# Altium schematic sheet NFC-Interface.SchDoc
size A3
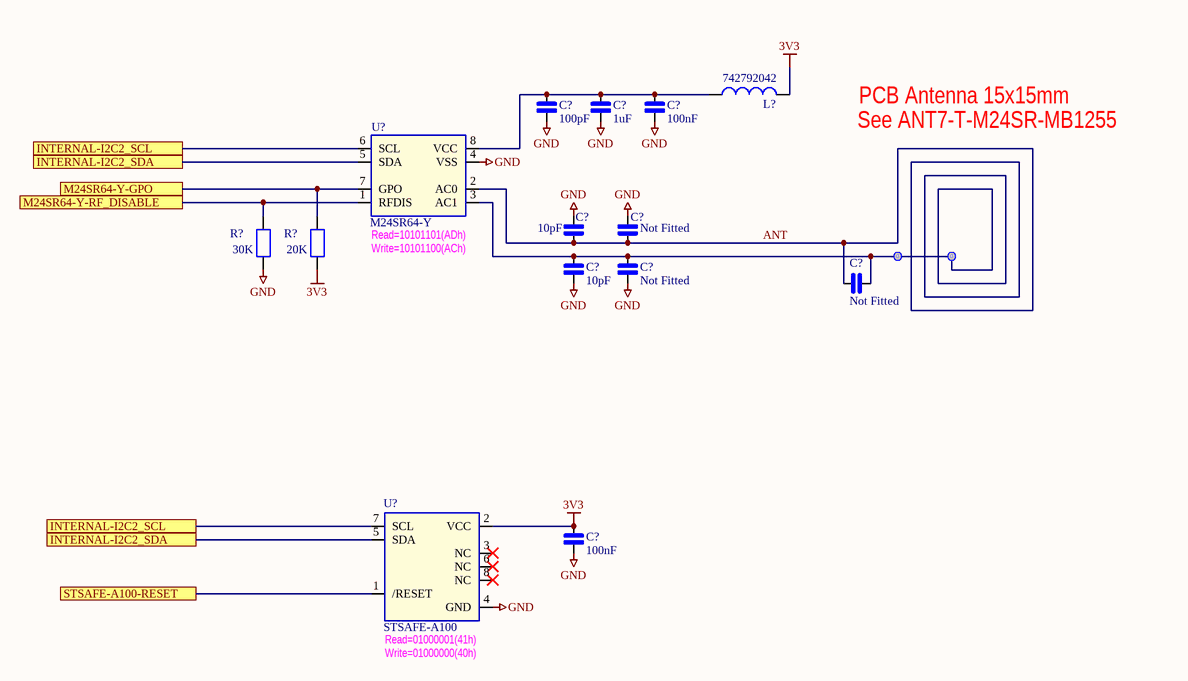
[diagram p0: NFC-Interface.SchDoc]

## Parts
(Parts that share a designator on the sheet are numbered #1, #2 ... from top to bottom, then left to right.)
C?#1  100pF  [0402_CAP_NPOL]
C?#2  1uF  [0402_CAP_NPOL]
C?#3  100nF  [0402_CAP_NPOL]
C?#4  10pF  [0402_CAP_NPOL]
C?#5  Not Fitted  [0402_CAP_NPOL]
C?#6  10pF  [0402_CAP_NPOL]
C?#7  Not Fitted  [0402_CAP_NPOL]
C?#8  Not Fitted  [0402_CAP_NPOL]
C?#9  100nF  [0402_CAP_NPOL]
L?  742792042  [0603L]
R?#1  30K  [0402_RES]
R?#2  20K  [0402_RES]
U?#1  M24SR64-Y  [SOP8]
U?#2  STSAFE-A100  [SOP8]

## Ports
INTERNAL-I2C2_SCL, INTERNAL-I2C2_SDA, M24SR64-Y-GPO, M24SR64-Y-RF_DISABLE, STSAFE-A100-RESET

## Nets
3V3: C?#9.1 L?.2 R?#2.1 U?#2.2(VCC)
GND: C?#1.2 C?#2.2 C?#3.2 C?#4.2 C?#5.2 C?#6.2 C?#7.2 C?#9.2 R?#1.1 U?#1.4(VSS) U?#2.4(GND)
ANT: C?#4.1 C?#5.1 C?#6.1 C?#7.1 C?#8.1 C?#8.2 U?#1.2(AC0) U?#1.3(AC1)
INTERNAL-I2C2_SCL: U?#1.6(SCL) U?#2.7(SCL) ; port INTERNAL-I2C2_SCL
INTERNAL-I2C2_SDA: U?#1.5(SDA) U?#2.5(SDA) ; port INTERNAL-I2C2_SDA
M24SR64-Y-GPO: R?#2.2 U?#1.7(GPO) ; port M24SR64-Y-GPO
M24SR64-Y-RF_DISABLE: R?#1.2 U?#1.1(RFDIS) ; port M24SR64-Y-RF_DISABLE
STSAFE-A100-RESET: U?#2.1(/RESET) ; port STSAFE-A100-RESET
NetC?#1_1: C?#1.1 C?#2.1 C?#3.1 L?.1 U?#1.8(VCC)

Not connected (* = marked no-connect by the designer): U?#2 3(NC)* 6(NC)* 8(NC)*

## Notes on the sheet
- See ANT7-T-M24SR-MB1255
- PCB Antenna 15x15mm
- (near U?#1) Read=10101101(ADh)
- Write=10101100(ACh)
- (near U?#2) Read=01000001(41h)
- (near U?#2) Write=01000000(40h)

## Library data of the parts
C?#1-C?#9 = CAP_NPOL: Capacitor_not polarized
L? = Inductor: Value: 100uH; Published: 8-Jun-2000; Revision: July-2002: Re-released for DXP Platform.; Publisher: Altium Limited
R?#1 R?#2 = RES: Resistor
U?#1 = M24SR64-Y: M24SR64-Y  64K_EEPROM NFC/RFID